# Altium schematic sheet CEU Camera.SchDoc
size A3; Company Name: Renesas Electronics America; CompanyURL: www.renesas.com; PageSetup: Record=PageOptions|CenterHorizontal=True|CenterVertical=True|PrintScale=1.00|XCorrection=1.00|YCorrection=1.00|PrintKind=1|BorderSize=5000000|LeftOffset=0|BottomOffset=0|Orientation=2|PaperLength=1000|PaperWidth=1000|Scale=100|PaperSource=7|PrintQuality=-4|MediaType=1|DitherType=10|PaperKind=A5 148x210mm|PrintScaleMode=1; ReleaseDate: 16.09.2025; Version: MP; SheetNumber: 11; SheetTotal: 18; VariantNumber: 0; DSheetNumber: 1
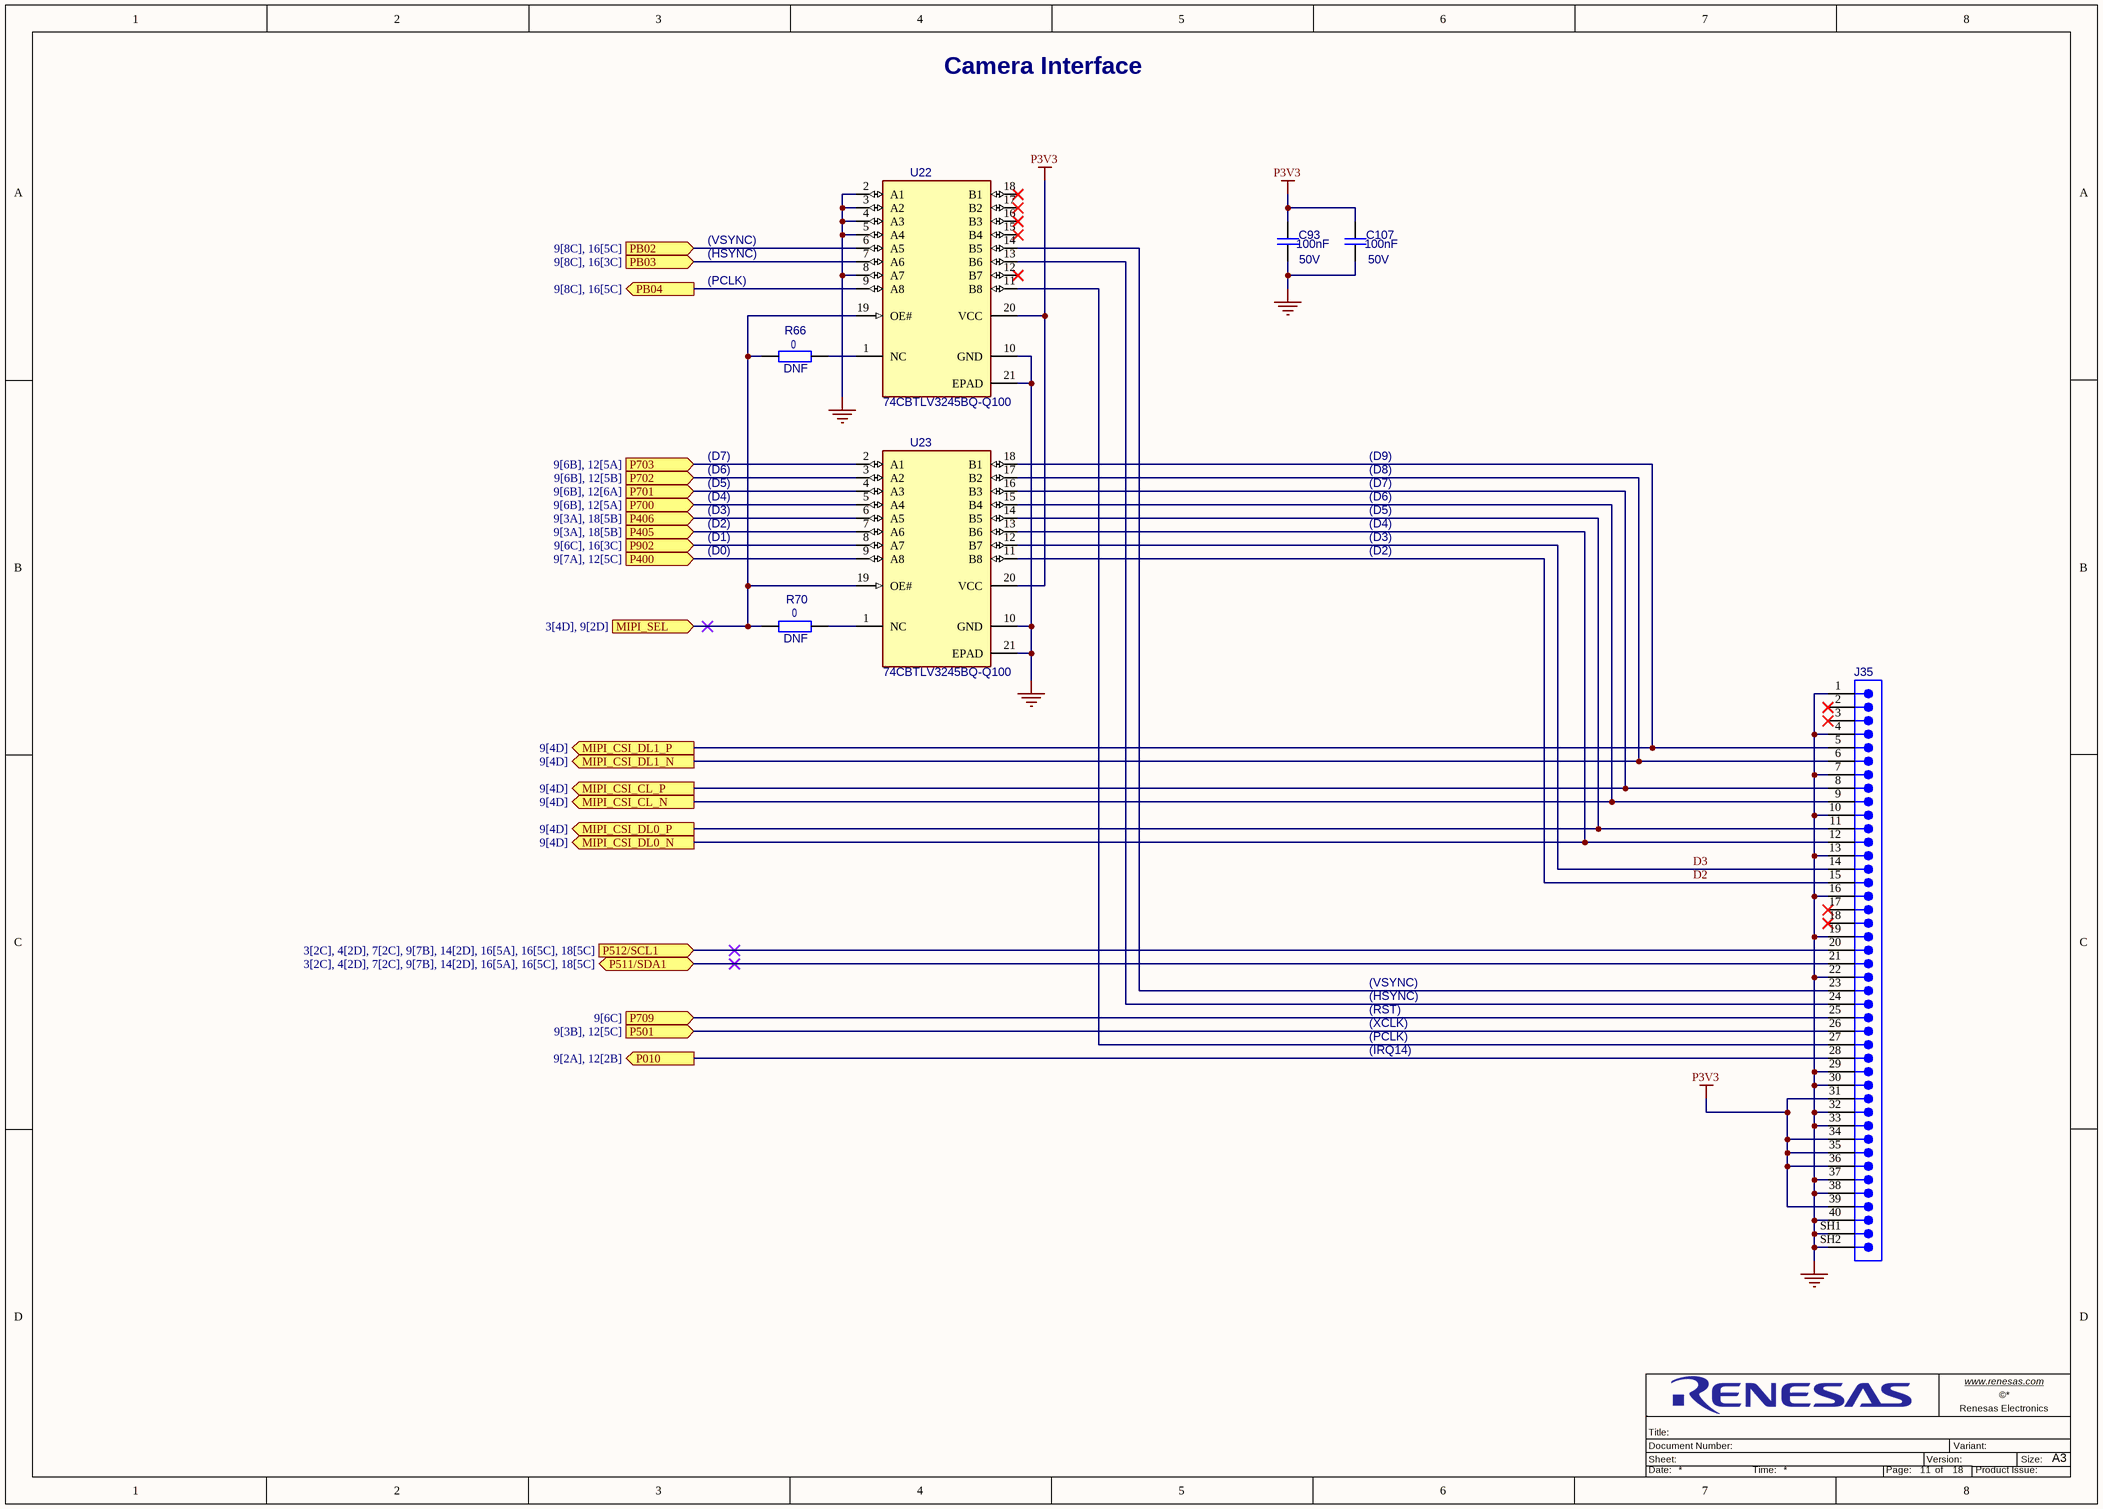
[diagram p0: CEU Camera.SchDoc]

## Parts
C93  value 100nF  Operating Voltage Max: 50V  [C_EIA0402_0p55]  (hidden comment: Capacitor)
C107  value 100nF  Operating Voltage Max: 50V  [C_EIA0402_0p55]  (hidden comment: Capacitor)
J35  505110-4091  [mol_505110-4091]  (value not drawn)
R66  value 0  [R_EIA0402]  (hidden comment: Resistor)
R70  value 0  [R_EIA0402]  (hidden comment: Resistor)
U22  74CBTLV3245BQ-Q100  [nex_SOT-764-1_DHVQFN20]
U23  74CBTLV3245BQ-Q100  [nex_SOT-764-1_DHVQFN20]

## Ports
MIPI_CSI_CL_N (out, see 9[4D]), MIPI_CSI_CL_P (out, see 9[4D]), MIPI_CSI_DL0_N (out, see 9[4D]), MIPI_CSI_DL0_P (out, see 9[4D]), MIPI_CSI_DL1_N (out, see 9[4D]), MIPI_CSI_DL1_P (out, see 9[4D]), MIPI_SEL (in, see 3[4D], 9[2D]), P010 (out, see 9[2A], 12[2B]), P400 (in, see 9[7A], 12[5C]), P405 (in, see 9[3A], 18[5B]), P406 (in, see 9[3A], 18[5B]), P501 (in, see 9[3B], 12[5C]), P511/SDA1 (bidir, see 3[2C], 4[2D], 7[2C], 9[7B], 14[2D], 16[5A], 16[5C], 18[5C]), P512/SCL1 (in, see 3[2C], 4[2D], 7[2C], 9[7B], 14[2D], 16[5A], 16[5C], 18[5C]), P700 (in, see 9[6B], 12[5A]), P701 (in, see 9[6B], 12[6A]), P702 (in, see 9[6B], 12[5B]), P703 (in, see 9[6B], 12[5A]), P709 (in, see 9[6C]), P902 (in, see 9[6C], 16[3C]), PB02 (in, see 9[8C], 16[5C]), PB03 (in, see 9[8C], 16[3C]), PB04 (out, see 9[8C], 16[5C])

## Nets
GND: C93.1 C107.1 J35.1 J35.4 J35.7 J35.10 J35.13 J35.16 J35.19 J35.22 J35.29 J35.30 J35.32 J35.33 J35.37 J35.38 J35.40 J35.SH1 J35.SH2 U22.2(A1) U22.3(A2) U22.4(A3) U22.5(A4) U22.8(A7) U22.10(GND) U22.21(EPAD) U23.10(GND) U23.21(EPAD)
P3V3: C93.2 C107.2 J35.31 J35.34 J35.35 J35.36 J35.39 U22.20(VCC) U23.20(VCC)
D2: J35.15 U23.11(B8)
D3: J35.14 U23.12(B7)
MIPI_CSI_CL_N: J35.9 U23.15(B4) ; port MIPI_CSI_CL_N
MIPI_CSI_CL_P: J35.8 U23.16(B3) ; port MIPI_CSI_CL_P
MIPI_CSI_DL0_N: J35.12 U23.13(B6) ; port MIPI_CSI_DL0_N
MIPI_CSI_DL0_P: J35.11 U23.14(B5) ; port MIPI_CSI_DL0_P
MIPI_CSI_DL1_N: J35.6 U23.17(B2) ; port MIPI_CSI_DL1_N
MIPI_CSI_DL1_P: J35.5 U23.18(B1) ; port MIPI_CSI_DL1_P
MIPI_SEL: R66.1 R70.1 U22.19(OE#) U23.19(OE#) ; port MIPI_SEL
P010: J35.28 ; port P010
P400: U23.9(A8) ; port P400
P405: U23.7(A6) ; port P405
P406: U23.6(A5) ; port P406
P501: J35.26 ; port P501
P511/SDA1: J35.21 ; port P511/SDA1
P512/SCL1: J35.20 ; port P512/SCL1
P700: U23.5(A4) ; port P700
P701: U23.4(A3) ; port P701
P702: U23.3(A2) ; port P702
P703: U23.2(A1) ; port P703
P709: J35.25 ; port P709
P902: U23.8(A7) ; port P902
PB02: U22.6(A5) ; port PB02
PB03: U22.7(A6) ; port PB03
PB04: U22.9(A8) ; port PB04
NetJ35_23: J35.23 U22.14(B5)
NetJ35_24: J35.24 U22.13(B6)
NetJ35_27: J35.27 U22.11(B8)
NetR66_2: R66.2 U22.1(NC)
NetR70_2: R70.2 U23.1(NC)

Not connected (* = marked no-connect by the designer): J35 2* 3* 17* 18*; U22 12(B7)* 15(B4)* 16(B3)* 17(B2)* 18(B1)*

## Notes on the sheet
- Camera Interface
- (VSYNC)
- (HSYNC)
- (PCLK)
- (D6)
- (D4)
- (D7)
- (D5)
- (D3)
- (D9)
- (D8)
- (D0)
- (D1)
- (D2)
- (IRQ14)
- (RST)
- (XCLK)
- www.renesas.com <http://www.renesas.com>
- Sheet:
- Title:
- Document Number:
- Version:
- Variant:
- Renesas Electronics
- Size:
- A3
- Date:
- Time:
- Page:
- of
- Product Issue:

## Library data of the parts
C93 C107 = CAP-00003203-9: Capacitor,EIA0402,100n,50V,X7R; Tolerance: 10%; Qualification: AEC-Q200; Subtype: MLCC; Dielectric: X7R; Height: 550µm; Operating Temperature Max: 125°C; Operating Temperature Min: -55°C
J35 = CON-00000066-2: FFC/FPC Connector, 40 Contact(s), 1 Row(s), Female, Right Angle, 0.019 inch Pitch, Surface Mount Terminal, Locking, Beige Insulator; Operating Voltage Max: 50V; Current: 500mA; Operating Temperature Max: 105°C; Gender: female; Qualification: -; Pin Count: 42; Height: 1.9mm; Operating Temperature Min: -40°C
R66 R70 = RES-00000801-9: Resistor,EIA0402,0,0.0625W; Power: 62.5mW; Tolerance: 5%; Subtype: Chip Resistor; Operating Temperature Max: 155°C; Operating Temperature Min: -55°C; Qualification: -; DNF: DNF
U22 U23 = ICS-00000017-5: Octal FET Bus Switch, 5 ohm, 0.3ns max delay, DHVQFN20; Current: 128mA; Operating Voltage Max: 3.6V; Operating Voltage Min: 2.3V; Output Voltage Min: 0V; Qualification: AEC-Q100; Operating Temperature Max: 125°C; Operating Temperature Min: -40°C; Output Voltage Max: 3.6V; Pin Count: 21; Subtype: Bus Switch